# Altium schematic sheet qre1113.SchDoc
size A4; SheetNumber: 5; SheetTotal: 5
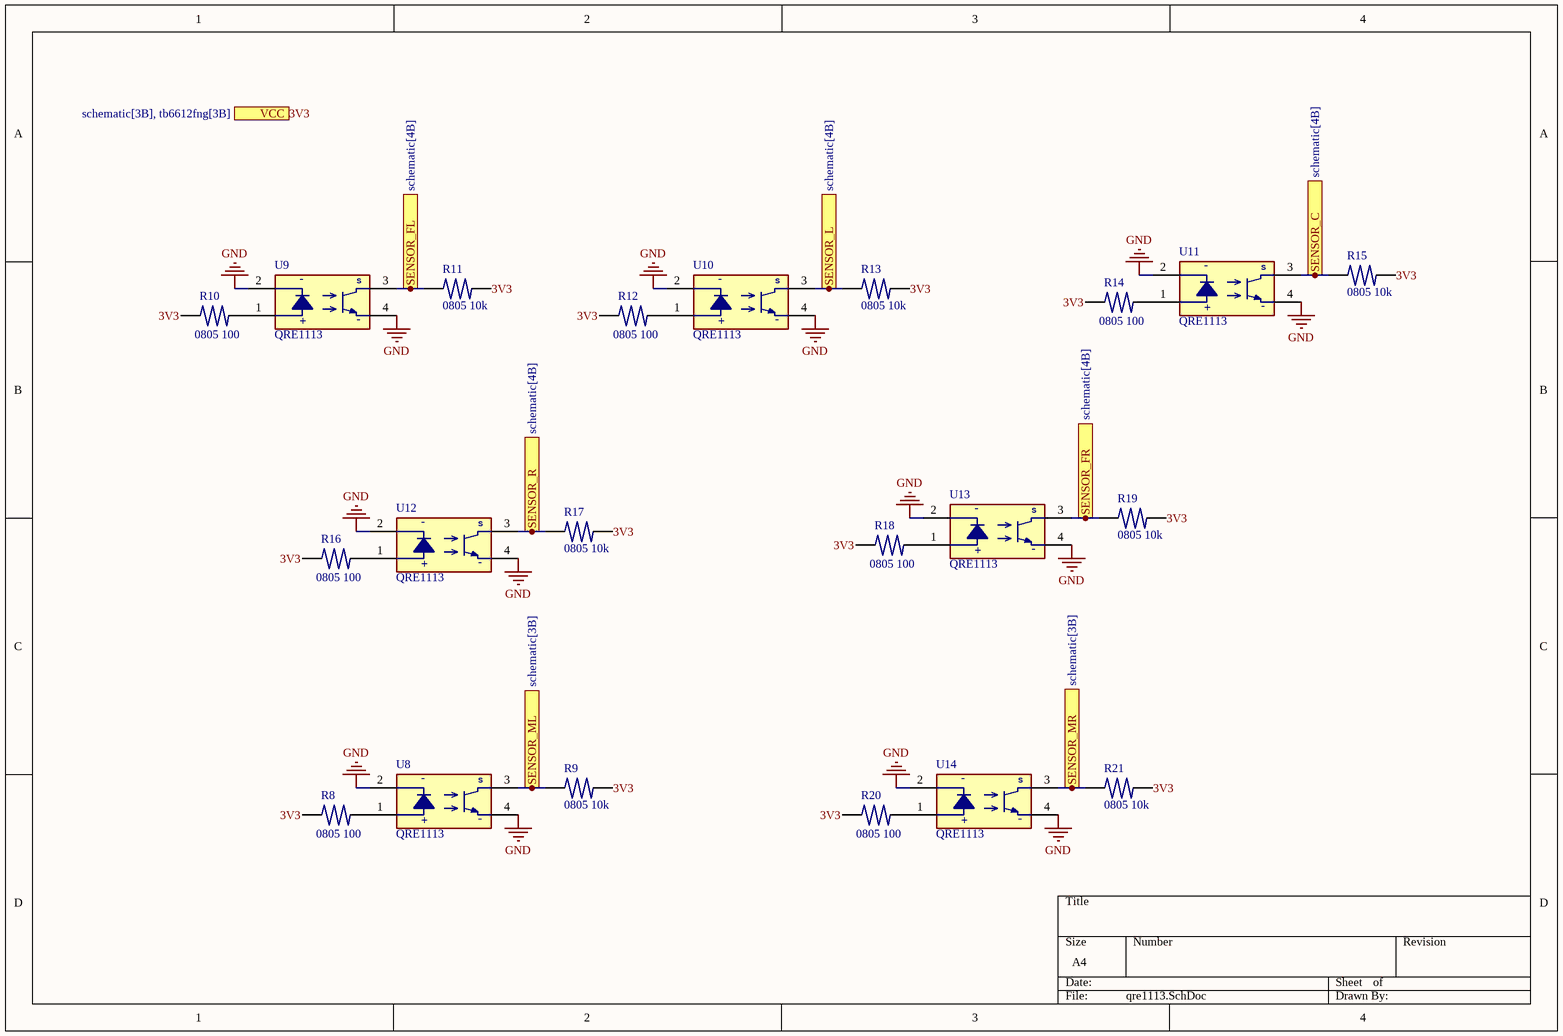
[diagram p0: qre1113.SchDoc]

## Parts
R8  0805 100  [RESISTOR_0805]
R9  0805 10k  [RESISTOR_0805]
R10  0805 100  [RESISTOR_0805]
R11  0805 10k  [RESISTOR_0805]
R12  0805 100  [RESISTOR_0805]
R13  0805 10k  [RESISTOR_0805]
R14  0805 100  [RESISTOR_0805]
R15  0805 10k  [RESISTOR_0805]
R16  0805 100  [RESISTOR_0805]
R17  0805 10k  [RESISTOR_0805]
R18  0805 100  [RESISTOR_0805]
R19  0805 10k  [RESISTOR_0805]
R20  0805 100  [RESISTOR_0805]
R21  0805 10k  [RESISTOR_0805]
U8  QRE1113  [QRE1113]
U9  QRE1113  [QRE1113]
U10  QRE1113  [QRE1113]
U11  QRE1113  [QRE1113]
U12  QRE1113  [QRE1113]
U13  QRE1113  [QRE1113]
U14  QRE1113  [QRE1113]

## Ports
SENSOR_C (see schematic[4B]), SENSOR_FL (see schematic[4B]), SENSOR_FR (see schematic[4B]), SENSOR_L (see schematic[4B]), SENSOR_ML (see schematic[3B]), SENSOR_MR (see schematic[3B]), SENSOR_R (see schematic[4B]), VCC (see schematic[3B], tb6612fng[3B])

## Nets
GND: U8.2(GND) U8.4(GND) U9.2(GND) U9.4(GND) U10.2(GND) U10.4(GND) U11.2(GND) U11.4(GND) U12.2(GND) U12.4(GND) U13.2(GND) U13.4(GND) U14.2(GND) U14.4(GND)
3V3: R8.1 R9.2 R10.1 R11.2 R12.1 R13.2 R14.1 R15.2 R16.1 R17.2 R18.1 R19.2 R20.1 R21.2 ; port VCC
SENSOR_C: R15.1 U11.3(SIGNAL) ; port SENSOR_C
SENSOR_FL: R11.1 U9.3(SIGNAL) ; port SENSOR_FL
SENSOR_FR: R19.1 U13.3(SIGNAL) ; port SENSOR_FR
SENSOR_L: R13.1 U10.3(SIGNAL) ; port SENSOR_L
SENSOR_ML: R9.1 U8.3(SIGNAL) ; port SENSOR_ML
SENSOR_MR: R21.1 U14.3(SIGNAL) ; port SENSOR_MR
SENSOR_R: R17.1 U12.3(SIGNAL) ; port SENSOR_R
NetR8_2: R8.2 U8.1(VCC)
NetR10_2: R10.2 U9.1(VCC)
NetR12_2: R12.2 U10.1(VCC)
NetR14_2: R14.2 U11.1(VCC)
NetR16_2: R16.2 U12.1(VCC)
NetR18_2: R18.2 U13.1(VCC)
NetR20_2: R20.2 U14.1(VCC)

## Notes on the sheet
- (in symbol QRE1113) -; S; +

## Library data of the parts
R8-R21 = RESISTOR_0805
U8-U14 = QRE1113: REFLECTIVE OPTICAL SENSOR SMD; Digikey PN: 512-QRE1113GR; ComponentLink1Description: Datasheet; ComponentLink1URL: https://br.mouser.com/datasheet/2/308/QRE1113_D-1814544.pdf